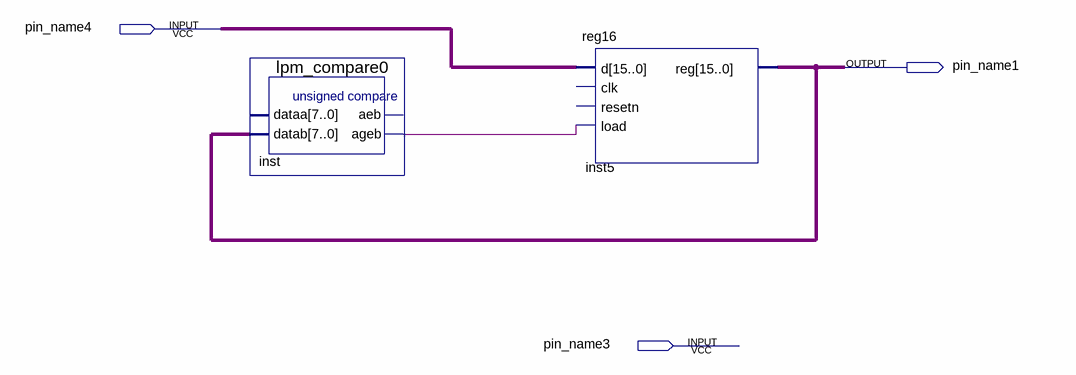
[diagram p0: schematic sheet]
// Quartus schematic comparator.bdf as structural Verilog: 2 symbols, 3 pins
module comparator (
  input  pin_name4,
  input  pin_name3,
  output pin_name1
);

  wire inst_ageb;
  wire [15:0] inst5_reg, undriven;

  lpm_compare0 inst (.datab(inst5_reg), .ageb(inst_ageb));  // open: dataa, aeb
  reg16 inst5 (.d(undriven), .load(inst_ageb), .\reg (inst5_reg));  // open: clk, resetn
endmodule
